# Altium schematic sheet Analog_Testvoltage_Output.SchDoc
size A4; PageSetup: Record=PageOptions|CenterHorizontal=True|CenterVertical=True|PrintScale=0.92|XCorrection=1.00|YCorrection=1.00|PrintKind=0|BorderSize=5000000|LeftOffset=0|BottomOffset=0|Orientation=2|PaperLength=1000|PaperWidth=1000|Scale=100|PaperSource=7|PrintQuality=-4|MediaType=1|DitherType=10|PrintScaleMode=1|PaperKind=A4; CompanyName: Technische Hochschule Nürnberg Georg Simon Ohm; Organization: UltraZohm; Address1: Kesslerplatz 12; Address2: 90489 Nürnberg; Address3: GERMANY; DocumentNumber: 3; SheetNumber: 3; SheetTotal: 5; Website: www.ultrazohm.com
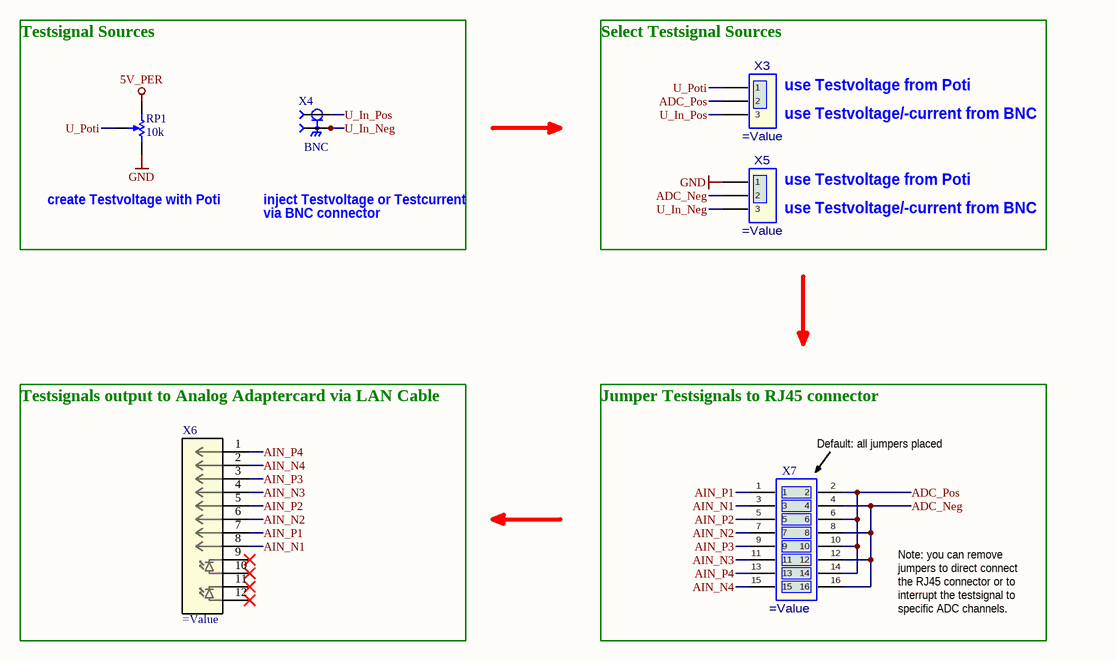
[diagram p0: Analog_Testvoltage_Output.SchDoc]

## Parts
RP1  10k  [BOURNS_3299W-3_V]
X3  (no value)  [TSW-103-XX-XXX-S]
X4  BNC  [SAMTEC_BNC7T-J-P-XX-RA-BH1]
X5  (no value)  [TSW-103-XX-XXX-S]
X6  (no value)  [RJ45_RJHSE-5384_AMP]
X7  (no value)  [TSW-108-XX-XXX-D]

## Blocks framed on the sheet
Default: all jumpers placed: X7

## Nets
5V_PER: RP1.1
GND: RP1.3 X5.1
ADC_Neg: X5.2 X7.4 X7.8 X7.12 X7.16
ADC_Pos: X3.2 X7.2 X7.6 X7.10 X7.14
AIN_N1: X6.8 X7.3
AIN_N2: X6.6 X7.7
AIN_N3: X6.4 X7.11
AIN_N4: X6.2 X7.15
AIN_P1: X6.7 X7.1
AIN_P2: X6.5 X7.5
AIN_P3: X6.3 X7.9
AIN_P4: X6.1 X7.13
U_In_Neg: X4.S1 X4.S2 X4.S3 X4.S4 X5.3
U_In_Pos: X3.3 X4.1
U_Poti: RP1.2 X3.1

Not connected (* = marked no-connect by the designer): X6 9* 10* 11* 12*

## Notes on the sheet
- Testsignal Sources
- (near X3) Select Testsignal Sources
- (near X3) use Testvoltage from Poti
- (near X3) use Testvoltage/-current from BNC
- (near RP1) create Testvoltage with Poti
- inject Testvoltage or Testcurrent
- via BNC connector
- (near X5) use Testvoltage from Poti
- (near X5) use Testvoltage/-current from BNC
- (near X6) Testsignals output to Analog Adaptercard via LAN Cable
- Jumper Testsignals to RJ45 connector
- Note: you can remove jumpers to direct connect the RJ45 connector or to interrupt the testsignal to specific ADC channels.
- Title
- Revision:
- Design Engineer:
- Date:
- Project:
- Sheet
- of

## Library data of the parts
RP1 = Trimmer_3299W: Square Trimpot(R) Trimming Potentiometer, 10kOhm, +/- 10%, 500 mW, -55 to 125 degC, 3-Pin THD, RoHS, Tube; MPN: 3299W-1-103LF; MF: Bourns; Value: 10k; ComponentLink1Description: Datasheet; ComponentLink1URL: http://www.bourns.com/docs/Product-Datasheets/3299.pdf; Supplier 1: Mouser; Supplier Part Number 1: 652-3299W-1-103LF; Created: 2020_12_15_AGeiger
X3 X5 = TSW-103-XX-XXX-S: .025[0.64] SQ. POST TERMINAL STRIP ASSEMBLY.; Manufacturer: SAMTEC; MPN: TSW-103-07-F-S; Value: TSW-103-07-F-S; Created: 2020_11_26_AGeiger
X4 = BNC7T-J-P-XX-RA-BH1: BNC Connector Jack, Female Socket 75Ohm Panel Mount, Through Hole, Right Angle Solder; MPN: BNC7T-J-P-HN-RA-BH1; MF: Samtec; Package: BNC; Value: BNC; Created: 2021_04_06_AGeiger; ComponentLink1Description: Datasheet; ComponentLink1URL: https://suddendocs.samtec.com/catalog_english/bnc7t.pdf; ComponentLink2Description: URL; ComponentLink2URL: https://www.samtec.com/products/bnc7t-j-p-gn-ra-bh1
X6 = RJHSE-5381: RJ45 without integrated trafos; MF: Amphenol; OperationTempMin: -55°C; OperationTempMax: +85°C; MPN: RJHSE-5381; Created: 2021_03_11_AGeiger; Supplier 1: Mouser; Supplier Part Number 1: 523-RJHSE-5381; ComponentLink1Description: Datasheet; ComponentLink1URL: https://cdn.amphenol-icc.com/media/wysiwyg/files/drawing/rjhse538x.pdf; Value: RJHSE-5381; Package: RJ45
X7 = TSW-108-XX-XXX-D: Pin Header, 2.54mm; MPN: TSW-108-07-F-D; MF: SAMTEC; Value: TSW-108-07-F-D; Created: 2019_02_10_AGeiger